# Altium schematic sheet MAGIsDebugger-JLink.SchDoc
size A4
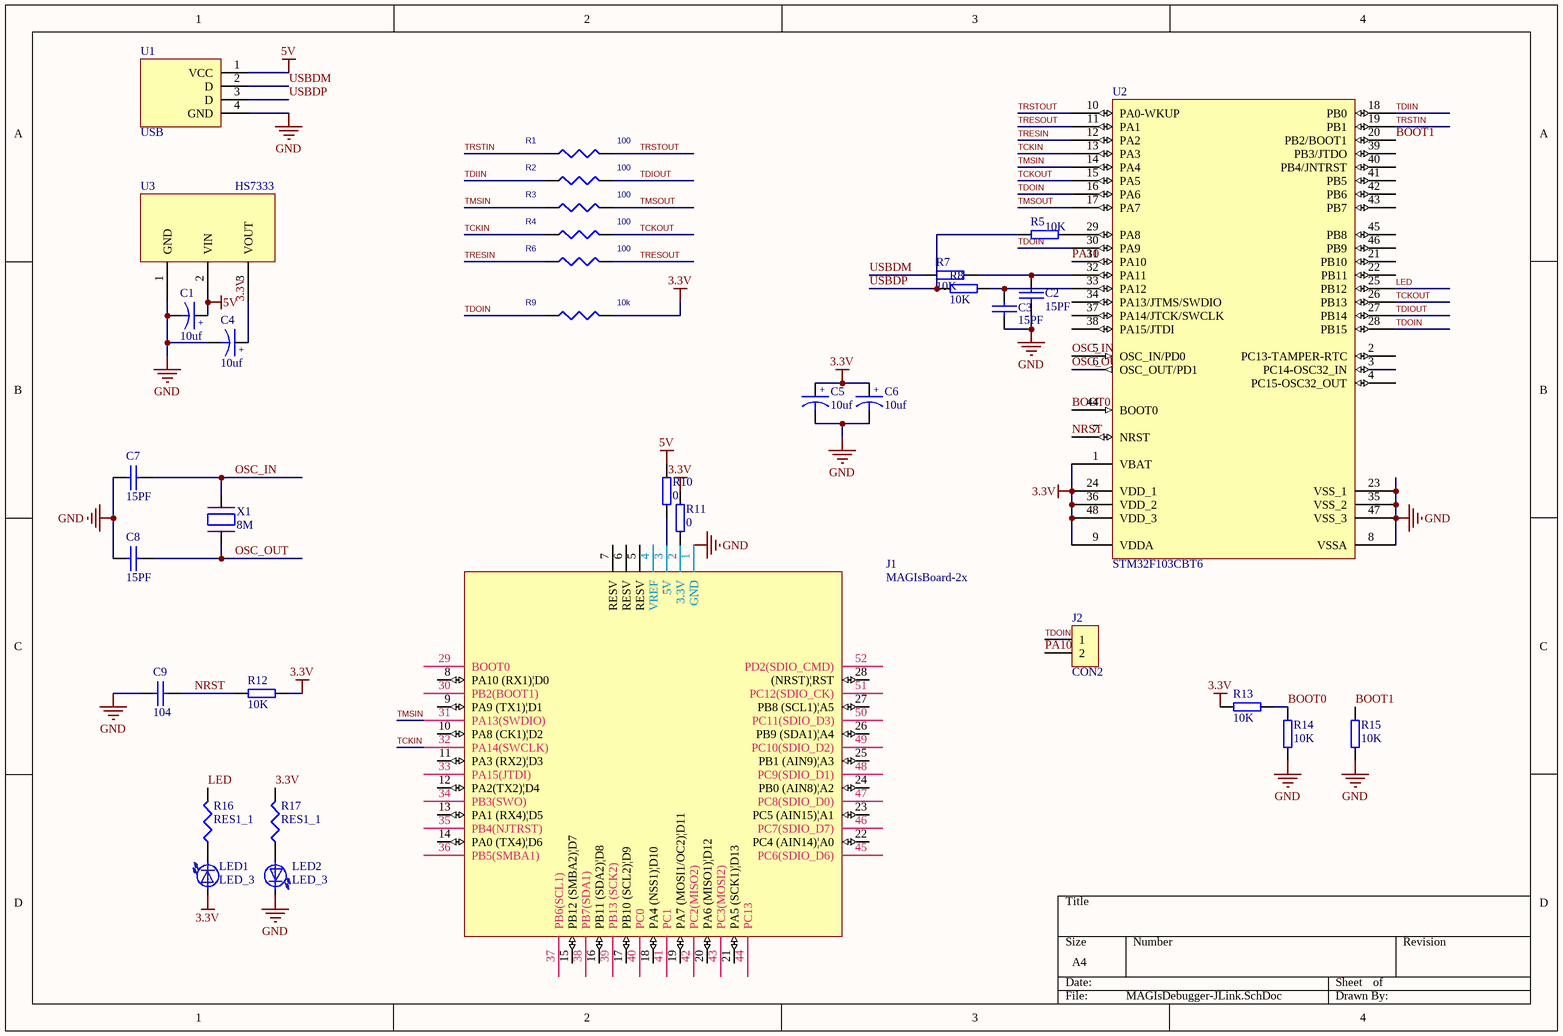
[diagram p0: MAGIsDebugger-JLink.SchDoc]

## Parts
C1  10uf  [6-0805_n]
C2  15PF  [6-0805_n]
C3  15PF  [6-0805_n]
C4  10uf  [6-0805_n]
C5  10uf  [6-0805_n]
C6  10uf  [6-0805_N]
C7  15PF  [6-0805_n]
C8  15PF  [6-0805_n]
C9  104  [6-0805_n]
J1  MAGIsBoard-2x  [MAGIsBoard-2x]
J2  CON2  [SIP2]
LED1  LED_3  [6-0805_n]
LED2  LED_3  [6-0805_n]
R1  100  [6-0805_N]
R2  100  [6-0805_N]
R3  100  [6-0805_N]
R4  100  [6-0805_N]
R5  10K  [6-0805_n]
R6  100  [6-0805_N]
R7  10K  [6-0805_n]
R8  10K  [6-0805_n]
R9  10k  [6-0805_N]
R10  0  [6-0805_n]
R11  0  [6-0805_n]
R12  10K  [6-0805_n]
R13  10K  [6-0805_n]
R14  10K  [6-0805_n]
R15  10K  [6-0805_n]
R16  RES1_1  [6-0805_n]
R17  RES1_1  [6-0805_n]
U1  USB  [microUSB]
U2  STM32F103CBT6  [LQFP48_N]
U3  HS7333  [HS7333]
X1  8M  [5032]

## Nets
3.3V: C4.1 C5.1 C6.1 LED1.1(A) R9.2 R11.1 R12.2 R13.2 R17.2 U2.1(VBAT) U2.9(VDDA) U2.24(VDD_1) U2.36(VDD_2) U2.48(VDD_3) U3.3(VOUT)
5V: C1.1 R10.1 U1.1(VCC) U3.2(VIN)
GND: C1.2 C2.1 C3.1 C4.2 C5.2 C6.2 C7.1 C8.1 C9.1 J1.1(GND) LED2.2(K) R14.1 R15.1 U1.4(GND) U2.8(VSSA) U2.23(VSS_1) U2.35(VSS_2) U2.47(VSS_3) U3.1(GND)
BOOT0: R13.1 R14.2 U2.44(BOOT0)
BOOT1: R15.2 U2.20(PB2/BOOT1)
LED: R16.2 U2.25(PB12)
NRST: C9.2 R12.1 U2.7(NRST)
OSC_IN: C7.2 U2.5(OSC_IN/PD0) X1.1
OSC_OUT: C8.2 U2.6(OSC_OUT/PD1) X1.2
PA10: J2.2 U2.31(PA10)
TCKIN: J1.32(PA14(SWCLK)) R4.1 U2.13(PA3)
TCKOUT: R4.2 U2.15(PA5) U2.26(PB13)
TDIIN: R2.1 U2.18(PB0)
TDIOUT: R2.2 U2.27(PB14)
TDOIN: J2.1 R9.1 U2.16(PA6) U2.28(PB15) U2.30(PA9)
TMSIN: J1.31(PA13(SWDIO)) R3.1 U2.14(PA4)
TMSOUT: R3.2 U2.17(PA7)
TRESIN: R6.1 U2.12(PA2)
TRESOUT: R6.2 U2.11(PA1)
TRSTIN: R1.1 U2.19(PB1)
TRSTOUT: R1.2 U2.10(PA0-WKUP)
USBDM: R7.1 U1.2(D)
USBDP: R5.1 R8.1 U1.3(D)
NetC2_2: C2.2 R7.2 U2.32(PA11)
NetC3_2: C3.2 R8.2 U2.33(PA12)
NetJ1_2: J1.2(3.3V) R11.2
NetJ1_3: J1.3(5V) R10.2
NetLED1_2: LED1.2(K) R16.1
NetLED2_1: LED2.1(A) R17.1
NetR5_2: R5.2 U2.29(PA8)

Not connected (* = marked no-connect by the designer): J1 4(VREF) 5(RESV) 6(RESV) 7(RESV) 8(PA10_(RX1)|D0) 9(PA9_(TX1)|D1) 10(PA8_(CK1)|D2) 11(PA3_(RX2)|D3) 12(PA2(TX2)|D4) 13(PA1_(RX4)|D5) 14(PA0_(TX4)|D6) 15(PB12_(SMBA2)|D7) 16(PB11_(SDA2)|D8) 17(PB10_(SCL2)|D9) 18(PA4_(NSS1)|D10) 19(PA7_(MOSI1/OC2)|D11) 20(PA6_(MISO1)|D12) 21(PA5_(SCK1)|D13) 22(PC4_(AIN14)|A0) 23(PC5_(AIN15)|A1) 24(PB0_(AIN8)|A2) 25(PB1_(AIN9)|A3) 26(PB9_(SDA1)|A4) 27(PB8_(SCL1)|A5) 28((NRST)|RST) 29(BOOT0) 30(PB2(BOOT1)) 33(PA15(JTDI)) 34(PB3(SWO)) 35(PB4(NJTRST)) 36(PB5(SMBA1)) 37(PB6(SCL1)) 38(PB7(SDA1)) 39(PB13_(SCK2)) 40(PC0) 41(PC1) 42(PC2(MISO2)) 43(PC3(MOSI2)) 44(PC13) 45(PC6(SDIO_D6)) 46(PC7(SDIO_D7)) 47(PC8(SDIO_D0)) 48(PC9(SDIO_D1)) 49(PC10(SDIO_D2)) 50(PC11(SDIO_D3)) 51(PC12(SDIO_CK)) 52(PD2(SDIO_CMD)); U2 2(PC13-TAMPER-RTC) 3(PC14-OSC32_IN) 4(PC15-OSC32_OUT) 21(PB10) 22(PB11) 34(PA13/JTMS/SWDIO) 37(PA14/JTCK/SWCLK) 38(PA15/JTDI) 39(PB3/JTDO) 40(PB4/JNTRST) 41(PB5) 42(PB6) 43(PB7) 45(PB8) 46(PB9)

## Notes on the sheet
- (in symbol CAPACITOR POL) +

## Library data of the parts
C1 C4-C6 = CAPACITOR POL: Capacitor
C2 C3 C7-C9 = CAP
J2 = CON2: Connector
R1-R4 R6 R9 = RESISTOR/SM
R5 R7 R8 R10-R15 = RES
U2 = STM32F103CBT6: STM32 ARM-based 32-bit MCU with 128 Kbytes Flash, 48-pin LQFP, Industrial Temperature; Published: 30-May-2008; DatasheetVersion: rev6, Mar-2008; PackageVersion: Mar-2008; PackageReference: LQFP48; Publisher: Altium Limited; PackageDescription: 48-Pin Low-Profile Quad Flat Pack, 7 x 7 mm Body, 0.5 mm Pitch (LQFP48); ComponentLink1Description: Manufacturer Link; ComponentLink1URL: www.st.com/stm32; ComponentLink2Description: Datasheet; ComponentLink2URL: http://www.st.com/stonline/products/literature/ds/13587.pdf
X1 = CRYSTAL